# EAGLE design Planks_Rev2 (EAGLE 8.2.2)
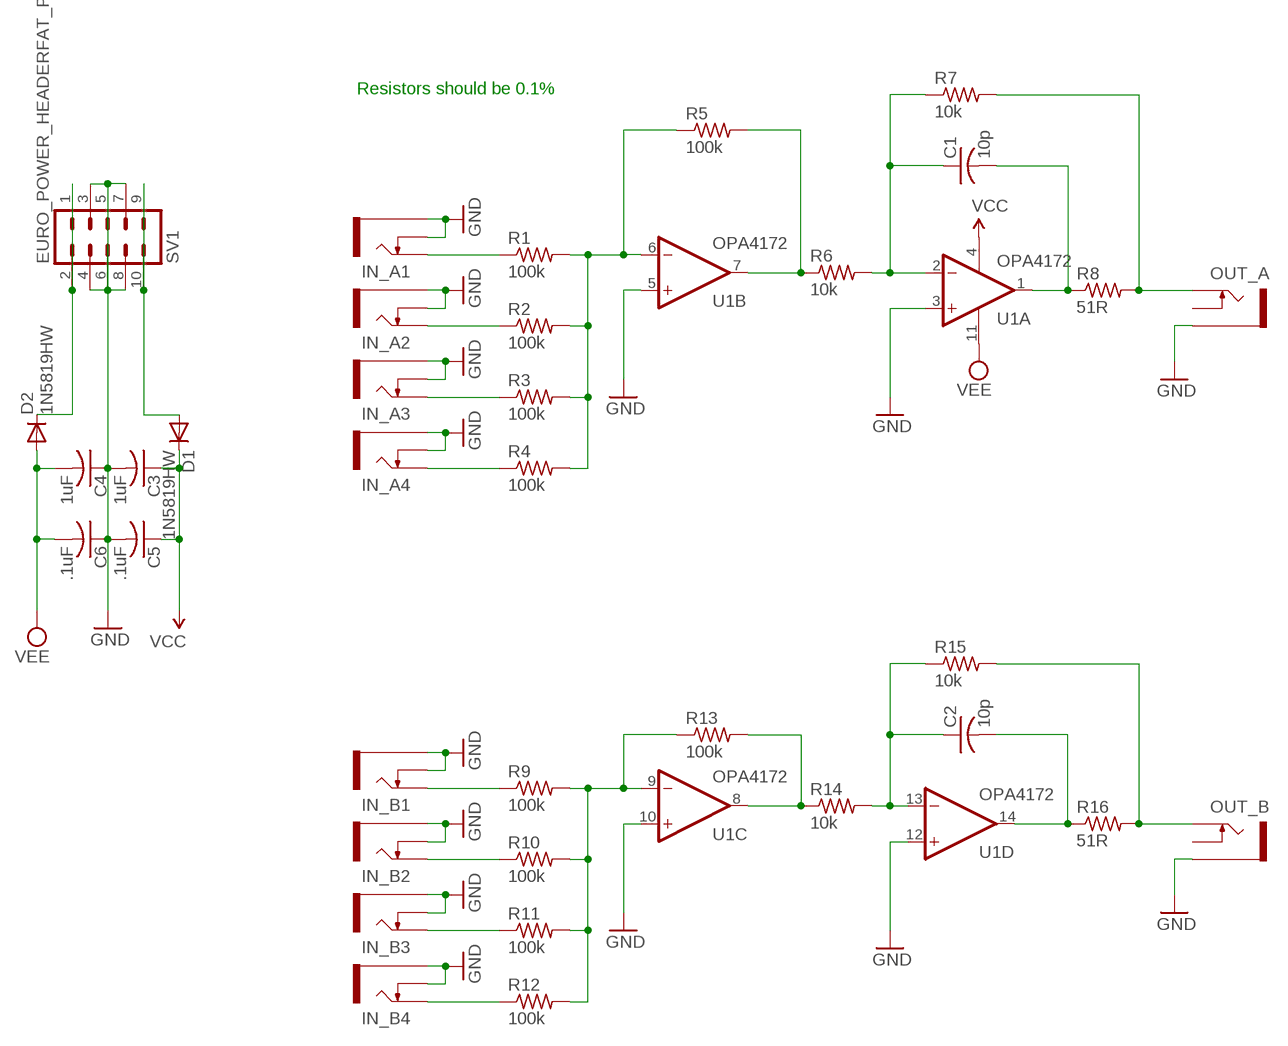
[diagram p0: schematic, sheet 1]

## Parts
C1  10p  C-USC0603  [C0603]
C2  10p  C-USC0603  [C0603]
C3  1uF  C-USC0805  [C0805]
C4  1uF  C-USC0805  [C0805]
C5  .1uF  C-USC0603  [C0603]
C6  .1uF  C-USC0603  [C0603]
D1  1N5819HW  DIODE-SOD123  [SOD123]
D2  1N5819HW  DIODE-SOD123  [SOD123]
IN_A1  THONKICONNNEW  [WQP-PJ301M-12_JACK]
IN_A2  THONKICONNNEW  [WQP-PJ301M-12_JACK]
IN_A3  THONKICONNNEW  [WQP-PJ301M-12_JACK]
IN_A4  THONKICONNNEW  [WQP-PJ301M-12_JACK]
IN_B1  THONKICONNNEW  [WQP-PJ301M-12_JACK]
IN_B2  THONKICONNNEW  [WQP-PJ301M-12_JACK]
IN_B3  THONKICONNNEW  [WQP-PJ301M-12_JACK]
IN_B4  THONKICONNNEW  [WQP-PJ301M-12_JACK]
OUT_A  THONKICONNNEW  [WQP-PJ301M-12_JACK]
OUT_B  THONKICONNNEW  [WQP-PJ301M-12_JACK]
R1  100k  R-US_R0603  [R0603]
R2  100k  R-US_R0603  [R0603]
R3  100k  R-US_R0603  [R0603]
R4  100k  R-US_R0603  [R0603]
R5  100k  R-US_R0603  [R0603]
R6  10k  R-US_R0603  [R0603]
R7  10k  R-US_R0603  [R0603]
R8  51R  R-US_R0603  [R0603]
R9  100k  R-US_R0603  [R0603]
R10  100k  R-US_R0603  [R0603]
R11  100k  R-US_R0603  [R0603]
R12  100k  R-US_R0603  [R0603]
R13  100k  R-US_R0603  [R0603]
R14  10k  R-US_R0603  [R0603]
R15  10k  R-US_R0603  [R0603]
R16  51R  R-US_R0603  [R0603]
SV1  EURO_POWER_HEADERFAT_PADS  [EURO_PWR_HEADER_FAT]
U1  OPA4172  TL074_SMD  [SO14]

## Nets
GND: C3.2 C4.1 C5.2 C6.1 IN_A1.P$2_SWITCH(SWITCH) IN_A1.P$3_SLEEVE(SLEEVE) IN_A2.P$2_SWITCH(SWITCH) IN_A2.P$3_SLEEVE(SLEEVE) IN_A3.P$2_SWITCH(SWITCH) IN_A3.P$3_SLEEVE(SLEEVE) IN_A4.P$2_SWITCH(SWITCH) IN_A4.P$3_SLEEVE(SLEEVE) IN_B1.P$2_SWITCH(SWITCH) IN_B1.P$3_SLEEVE(SLEEVE) IN_B2.P$2_SWITCH(SWITCH) IN_B2.P$3_SLEEVE(SLEEVE) IN_B3.P$2_SWITCH(SWITCH) IN_B3.P$3_SLEEVE(SLEEVE) IN_B4.P$2_SWITCH(SWITCH) IN_B4.P$3_SLEEVE(SLEEVE) OUT_A.P$3_SLEEVE(SLEEVE) OUT_B.P$3_SLEEVE(SLEEVE) SV1.3 SV1.4 SV1.5 SV1.6 SV1.7 SV1.8 U1.3(A:+IN) U1.5(B:+IN) U1.10(C:+IN) U1.12(D:+IN)
N$1: IN_A1.P$1_TIP(TIP) R1.1
N$2: IN_A4.P$1_TIP(TIP) R4.1
N$3: IN_A3.P$1_TIP(TIP) R3.1
N$4: IN_A2.P$1_TIP(TIP) R2.1
N$5: R1.2 R2.2 R3.2 R4.2 R5.1 U1.6(B:-IN)
N$6: IN_B1.P$1_TIP(TIP) R9.1
N$7: R5.2 R6.1 U1.7(B:OUT)
N$8: C1.1 R6.2 R7.1 U1.2(A:-IN)
N$9: IN_B4.P$1_TIP(TIP) R12.1
N$10: C1.2 R8.1 U1.1(A:OUT)
N$11: OUT_A.P$1_TIP(TIP) R7.2 R8.2
N$12: IN_B3.P$1_TIP(TIP) R11.1
N$13: IN_B2.P$1_TIP(TIP) R10.1
N$14: R9.2 R10.2 R11.2 R12.2 R13.1 U1.9(C:-IN)
N$15: R13.2 R14.1 U1.8(C:OUT)
N$16: C2.1 R14.2 R15.1 U1.13(D:-IN)
N$17: D1.A SV1.9 SV1.10
N$18: D2.C SV1.1 SV1.2
N$20: OUT_B.P$1_TIP(TIP) R15.2 R16.2
N$23: C2.2 R16.1 U1.14(D:OUT)
VCC: C3.1 C5.1 D1.C U1.4(P:V+)
VEE: C4.2 C6.2 D2.A U1.11(P:V-)
Unconnected: OUT_A.P$2_SWITCH(SWITCH) OUT_B.P$2_SWITCH(SWITCH)

## Notes on the sheet
- Resistors should be 0.1%

## Library data of the parts
C1-C6 = rcl:C-US: CAPACITOR, American symbol
D1 D2 = diode:DIODE-: DIODE
IN_A1-IN_A4 IN_B1-IN_B4 OUT_A OUT_B = MusicThingModular:THONKICONN: 3.5mm socket for Eurorack modular synths
R1-R16 = rcl:R-US_: RESISTOR, American symbol
SV1 = MusicThingModular:EURO_POWER_HEADER: Power Header 10 pin power header for Eurorack Power Supplies Variants with fatter pads for easier soldering, and the LOCK variant which has 5mil offset pins to hold the component in place before soldering
U1 = MusicThingModular:TL074: Generic Quad Op Amp

## Board
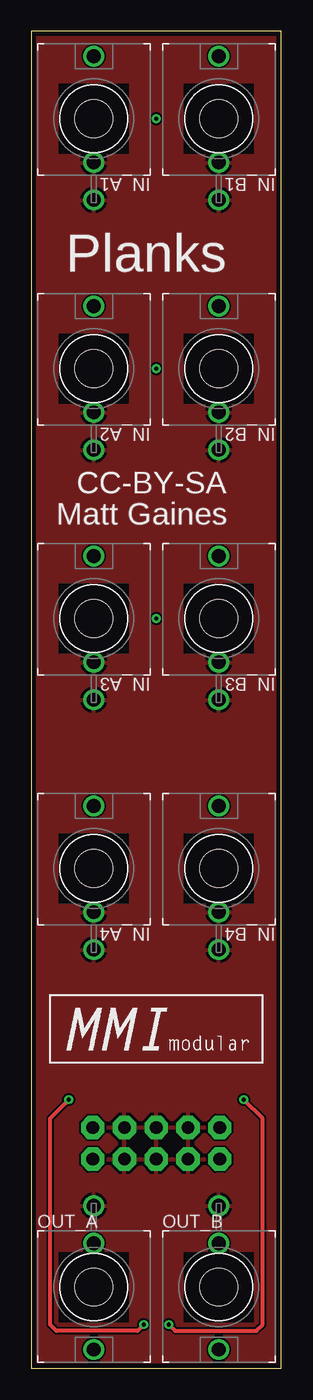
[diagram p1: board, top side]
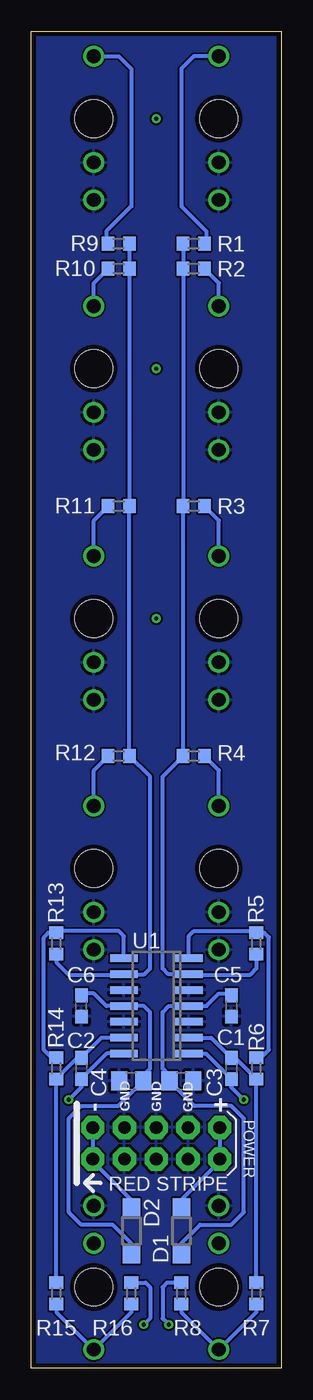
[diagram p2: board, bottom side, seen from below]

Size 20 x 107 mm. Coordinates in mm from the lower left corner, seen from the top.
Outline: 0,0 20,0 20,107 0,107 0,0
Copper layers (1*16): Top 0.0356mm / dielectric 1.5011mm / Bottom 0.0356mm
Design rules "LaenPCBOrder": minimum track width 6mil, minimum drill 13mil, track to track 6mil, track to pad 6mil, pad to pad 6mil, via to via 6mil, smd to smd 6mil, copper to edge 15mil, drill to drill 6mil, minimum pad ring 7mil, minimum via ring 7mil, stop-mask expansion 3mil, vias tented up to drill 0mil, thermal gap 10mil
Holes 3 mm at 5,6.5 15,6.5 15,40 5,40 5,60 15,60 15,80 5,80 5,100 15,100

### Footprints (pad centres in the part's own frame; a part is rotated, then mirrored left to right if it is on the bottom)
C0603 = smd 1.1 x 1: 1 -0.85,0; 2 0.85,0
C0805 = smd 1.3 x 1.5: 1 -0.95,0; 2 0.95,0
SOD123 = smd 1.4 x 1.4: A 1.9,0; C -1.9,0
WQP-PJ301M-12_JACK = drill 1.1: P$1_TIP 0,5; P$2_SWITCH 0,-3.5; P$3_SLEEVE 0,-6.5
R0603 = smd 1 x 1.1: 1 -0.85,0; 2 0.85,0
EURO_PWR_HEADER_FAT = drill 1.016 pad 1.88 octagon: 1 -5.08,-1.27; 2 -5.08,1.27; 3 -2.54,-1.27; 4 -2.54,1.27; 5 0,-1.27; 6 0,1.27; 7 2.54,-1.27; 8 2.54,1.27; 9 5.08,-1.27; 10 5.08,1.27
SO14 = smd 0.6 x 2.2: 1 -3.81,-2.6; 2 -2.54,-2.6; 3 -1.27,-2.6; 4 0,-2.6; 5 1.27,-2.6; 6 2.54,-2.6; 7 3.81,-2.6; 8 3.81,2.6; 9 2.54,2.6; 10 1.27,2.6; 11 0,2.6; 12 -1.27,2.6; 13 -2.54,2.6; 14 -3.81,2.6

### Placement (x,y rotation side)
C1  4,24 270 bottom
C2  16,24 270 bottom
C3  8,23 0 bottom
C4  12,23 0 bottom
C5  4,29 270 bottom
C6  16,29 90 bottom
D1  8,11 90 bottom
D2  12,11 270 bottom
IN_A1  5,100 0 top
IN_A2  5,80 0 top
IN_A3  5,60 0 top
IN_A4  5,40 0 top
IN_B1  15,100 0 top
IN_B2  15,80 0 top
IN_B3  15,60 0 top
IN_B4  15,40 0 top
OUT_A  5,6.5 180 top
OUT_B  15,6.5 180 top
R1  7,90 180 bottom
R2  7,88 180 bottom
R3  7,69 180 bottom
R4  7,49 180 bottom
R5  2,34 90 bottom
R6  2,24 270 bottom
R7  2,6 270 bottom
R8  8,6 270 bottom
R9  13,90 0 bottom
R10  13,88 0 bottom
R11  13,69 0 bottom
R12  13,49 0 bottom
R13  18,34 90 bottom
R14  18,24 270 bottom
R15  18,6 270 bottom
R16  12,6 270 bottom
SV1  10,18 0 bottom
U1  10,29 90 bottom

### Tracks (layer width: path | path; a pad name or v marks a point on that pad's centre or on a via)
GND
  pour Bottom: 0,0 20,0 20,107 0,107
  pour Top: 0,0 20.25,0 20.25,107.25 0.25,107.25 0,107
N$1
  Bottom 0.305: IN_A1.P$1_TIP 7,105 8,104 8,93 6,91 6,90.15 R1.1
N$2
  Bottom 0.305: IN_A4.P$1_TIP 5,47.85 R4.1
N$3
  Bottom 0.305: IN_A3.P$1_TIP 5,67.85 R3.1
N$4
  Bottom 0.305: IN_A2.P$1_TIP 5,86.85 R2.1
N$5
  Bottom 0.305: R5.1 2,32 2.5,31.5 7.36,31.5 U1.6 9.04,31.54 9.5,32 9.5,47.35 R4.2 R3.2 R2.2 R1.2
N$6
  Bottom 0.305: IN_B1.P$1_TIP 13,105 12,104 12,93 14,91 14,90.15 R9.1
N$7
  Bottom 0.305: U1.7 7.4,34.6 7,35 2.15,35 R5.2 1.35,34.85 1,34.5 1,25.5 1.65,24.85 R6.1
N$8
  Bottom 0.305: U1.2 5.61,26.46 C1.1 3.7,24.85 R6.2 R7.1
N$9
  Bottom 0.305: IN_B4.P$1_TIP 15,47.85 R12.1
N$10  (via drill 0.35)
  Top 0.305: v9,3.5 8.5,3 2,3 1.5,3.5 1.5,20 v3,21.5
  Bottom 0.305: U1.1 6.04,25.19 C1.2 4,22.5 v3,21.5 | R8.1 9.15,6.85 9.5,6.5 9.5,4 v9,3.5
N$11
  Bottom 0.305: R7.2 2,4.5 OUT_A.P$1_TIP 8,4.5 R8.2
N$12
  Bottom 0.305: IN_B3.P$1_TIP 15,67.85 R11.1
N$13
  Bottom 0.305: IN_B2.P$1_TIP 15,86.85 R10.1
N$14
  Bottom 0.305: R13.1 18,32.5 17,31.5 12.64,31.5 U1.9 10.96,31.54 10.5,32 10.5,47.35 R12.2 R11.2 R10.2 R9.2
N$15
  Bottom 0.305: U1.8 12.6,34.6 13,35 17.85,35 R13.2 18.65,34.85 19,34.5 19,25.5 18.35,24.85 R14.1
N$16
  Bottom 0.305: U1.13 14.39,26.46 C2.1 16.3,24.85 R14.2 R15.1
N$17
  Bottom 0.305: SV1.10 SV1.9 4.92,16.58 8,13.5 D1.A
N$18
  Bottom 0.305: SV1.2 SV1.1 15.08,16.58 12,13.5 D2.C
N$20
  Bottom 0.305: R16.2 12,4.5 OUT_B.P$1_TIP 18,4.5 R15.2
N$22  (via drill 0.35)
  other vias: 10,100
N$23  (via drill 0.35)
  Top 0.305: v11,3.5 11.5,3 18,3 18.5,3.5 18.5,20 v17,21.5
  Bottom 0.305: U1.14 13.96,25.19 C2.2 16,22.5 v17,21.5 | R16.1 10.85,6.85 10.5,6.5 10.5,4 v11,3.5
N$26  (via drill 0.35)
  other vias: 10,80
N$27  (via drill 0.35)
  other vias: 10,60
VCC
  Bottom 0.305: D1.C 8,10 6.5,11.5 4,11.5 3,12.5 3,20 4,21 6.95,21 C3.1 8.95,23.45 9.5,24 9.5,28.5 9,29 U1.4 6,29 5,30 4.15,30 C5.1
VEE
  Bottom 0.305: D2.A 12,10 13.5,11.5 16,11.5 17,12.5 17,20 16,21 13.05,21 C4.2 11.05,23.45 10.5,24 10.5,28.5 11,29 U1.11 14,29 15,30 15.85,30 C6.2

### Text on the board
tNames: Planks | CC-BY-SA | Matt Gaines